# Altium schematic sheet DCF_ALIM_SWITCH_RESET.SchDoc
size A4; Author: JCD
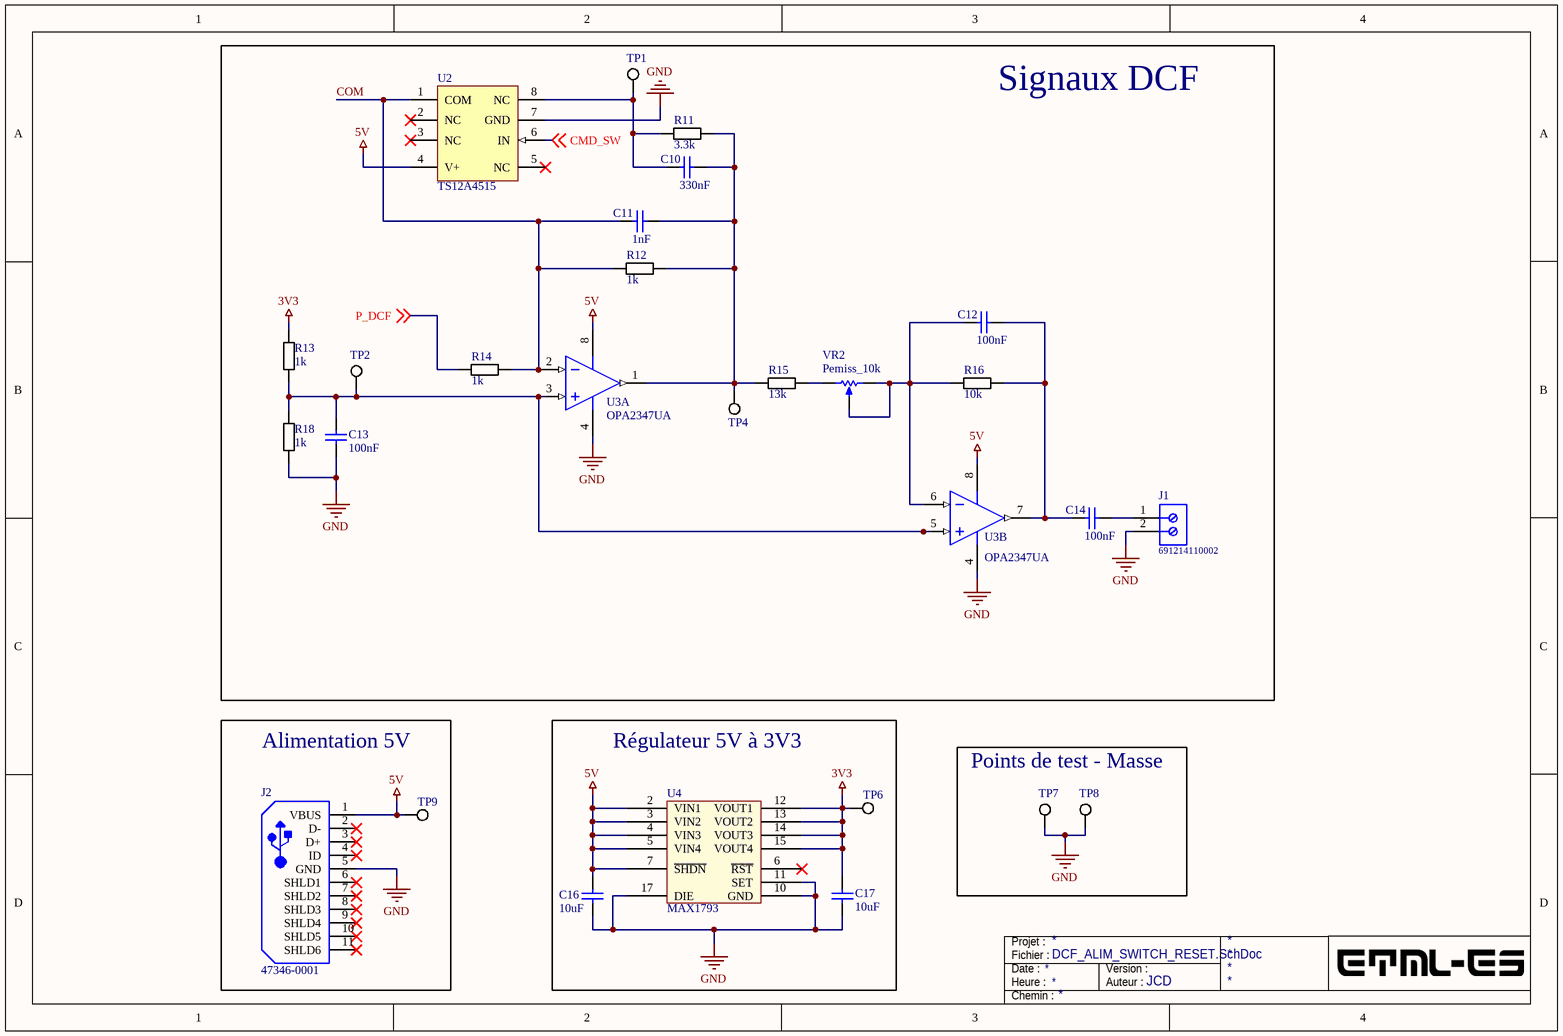
[diagram p0: DCF_ALIM_SWITCH_RESET.SchDoc]

## Parts
C10  330nF  [C0805]
C11  value 1nF  [C0805]  (hidden comment: 100nF)
C12  100nF  [C0805]
C13  100nF  [C0805]
C14  100nF  [C0805]
C16  10uF  [C0805]
C17  10uF  [C0805]
J1  691214110002  [691214110002]
J2  47346-0001  [MOLX-47346-0001-5_V]
R11  3.3k  [RESC0805(2012)_L]
R12  1k  [RESC0805(2012)_L]
R13  1k  [RESC0805(2012)_L]
R14  1k  [RESC0805(2012)_L]
R15  13k  [RESC0805(2012)_L]
R16  10k  [RESC0805(2012)_L]
R18  1k  [RESC0805(2012)_L]
TP1  5019  [KSTN-5019_V]  (value not drawn)
TP2  5019  [KSTN-5019_V]  (value not drawn)
TP4  5019  [KSTN-5019_V]  (value not drawn)
TP6  5019  [KSTN-5019_V]  (value not drawn)
TP7  5019  [KSTN-5019_V]  (value not drawn)
TP8  5019  [KSTN-5019_V]  (value not drawn)
TP9  5019  [KSTN-5019_V]  (value not drawn)
U2  TS12A4515  [TI-D8_L]
U3  OPA2347UA  [D0008A_M]  (parts A,B of 2)
U4  MAX1793  [MAX1793]
VR2  Pemiss_10k  [BOUR-3362P]

## Blocks framed on the sheet
Signaux DCF: C10-C14 J1 R11-R16 R18 TP1 TP2 TP4 U2 U3 VR2
Alimentation 5V: J2 TP9
Régulateur 5V à 3V3: C16 C17 TP6 U4
Points de test - Masse: TP7 TP8

## Nets
3V3: C17.2 R13.1 TP6.1 U4.12(VOUT1) U4.13(VOUT2) U4.14(VOUT3) U4.15(VOUT4)
5V: C16.2 J2.1(VBUS) TP9.1 U2.4(V+) U3.8(V+) U4.2(VIN1) U4.3(VIN2) U4.4(VIN3) U4.5(VIN4) U4.7(~{SHDN})
GND: C13.1 C16.1 C17.1 J1.2 J2.5(GND) R18.2 TP7.1 TP8.1 U2.7(GND) U3.4(V-) U4.10(GND) U4.11(SET) U4.17(DIE)
CMD_SW: U2.6(IN) ; off-sheet CMD_SW
COM: C11.2 R12.1 R14.2 U2.1(COM) U3.2(IN_A-)
P_DCF: R14.1 ; off-sheet P_DCF
NetC10_1: C10.1 C11.1 R11.2 R12.2 R15.1 TP4.1 U3.1(OUT_A)
NetC10_2: C10.2 R11.1 TP1.1 U2.8(NC)
NetC12_1: C12.1 C14.2 R16.2 U3.7(OUT_B)
NetC12_2: C12.2 R16.1 U3.6(IN_B-) VR2.2(S) VR2.3(CW)
NetC13_2: C13.2 R13.2 R18.1 TP2.1 U3.3(IN_A+) U3.5(IN_B+)
NetC14_1: C14.1 J1.1
NetR15_2: R15.2 VR2.1(CCW)

Not connected (* = marked no-connect by the designer): J2 2(D-)* 3(D+)* 4(ID)* 6(SHLD1)* 7(SHLD2)* 8(SHLD3)* 9(SHLD4)* 10(SHLD5)* 11(SHLD6)*; U2 2(NC)* 3(NC)* 5(NC)*; U4 6(~{RST})*

## Notes on the sheet
- Fichier :
- Date :
- Heure :
- Projet :
- Auteur :
- Version :
- Chemin :

## Library data of the parts
C10-C14 C16 C17 = Cap: Capacitor; Published: 8-Jun-2000; LatestRevisionDate: 17-Jul-2002; LatestRevisionNote: Re-released for DXP Platform.; PackageReference: RAD-0.3; Publisher: Altium Limited; PackageDescription: Radial Cap, Thru-Hole; 2 Leads; 0.3 in Pin Spacing
  C10: Value: 330nF
  C12-C14: Value: 100nF
  C16 C17: Value: 10uF
J1 = 691214110002: Serie 2141 - 3.50 mm Horizontal Entry Modular with Rising Cage Clamp WR-TBL, 2 pin; Pin Number: 2; Pitch: 3.50 mm; ComponentLink1Description: Manufacturer; ComponentLink1URL: http://www.we-online.de; ComponentLink2Description: Datasheet; ComponentLink2URL: http://katalog.we-online.de/em/datasheet/6912141100xx.pdf; Part Number: 691214110002; Published Date: June 2018; Publisher: Wurth Elektronik; Operating Temperature: -40 to 105 degC; Mounting Technology: THT; Packaging: Box
J2 = CMP-2000-05246-1: Micro-USB B Receptacle with Flange, -30 to 85 degC, 5-Pin SMD, RoHS, Tape and Reel; Manufacturer: Molex; Number of Contacts: 5; Body Orientation: RightAngle; Maximum Voltage Rating: 30VAC; Pitch: 0.65mm; Maximum Current Rating: 1.8/ContactA; Number of Ports: 1; Gender: RCP; Operating Temperature: -30to85C; Part No: 47346-0001; Color: Black; Termination Method: Solder; Contact Plating: GoldOverPalladiumNickelOverNickel; Dimension: 7.8x5.43x2.94mm; Number of Terminals: 5; Datasheet Version: Dec-13; Datasheet URL: https://datasheet.ciiva.com/30075/304740473460001-io-nectors-30075527.pdf; Contact Material: CopperAlloy; RoHS: Yes; Housing Material: LiquidCrystalPolymer; Manufacturer URL: http://www.molex.com/; Packaging: EmbossedTapeandReel; Mounting: SurfaceMount; Type: MicroUSBTypeB
R11-R16 R18 = Resistance
TP1 TP2 TP4 TP6-TP9 = CMP-1672-00008-1: Test Point, 1 Position SMD, RoHS, Tape and Reel; ComponentLink1Description: Manufacturer URL; Package Quantity: 1000; DatasheetVersion: 03/2014; Packaging: Tape and Reel; ComponentLink2URL: http://www.keyelco.com/product-pdf.cfm?p=1357; ComponentLink1URL: http://www.keyelco.com/; Mount: Surface Mount; Contact Plating: Silver; PackageDescription: 1-Pin Surface Mount Device, Body 3.81 x 2.03 mm; Pins: 1; RoHSCompliant: True; Mounting Technology: Surface Mount; ComponentLink2Description: Datasheet; PackageReference: 5019
U2 = TS12A4515: Dual Supply, Low On-State Resistance SPST CMOS Analog Switch, -40 to 85 degC, 8-Pin SOIC (D8), RoHS, Tube; Manufacturer: Texas Instruments; PartNumber: TS12A4516D; Channels: 1; Ron: 25 Ohm Max.; PackageDescription: 8-Pin Plastic Small Outline, Body 4.9 x 3.9 mm, Pitch 1.27 mm; ComponentLink1URL: http://www.ti.com/; Packing: Tube; ComponentLink2Description: Datasheet; PackageVersion: 4040047-3/M; Switch Configuration: SPST; ComponentLink1Description: Manufacturer URL; DatasheetVersion: SCDS236B; Temperature Range: -40 to 85 degC; ComponentLink3Description: Package Specification; PackageReference: D0008A; ComponentLink3URL: http://www.ti.com/lit/ml/msoi002j/msoi002j.pdf; RoHS: TRUE; ComponentLink2URL: http://www.ti.com/lit/ds/symlink/ts12a4516.pdf; Mounting Technology: Surface Mount
U3 = CMP-0272-00425-3: MicroPower, Rail-to-Rail Operational Amplifier, 2.3 to 5.5 V, -55 to 125 degC, 8-pin SOIC (D8), Green (RoHS & no Sb/Br); Manufacturer: Texas Instruments; Number of Channels: 2; Rating: Catalog; Sub Family: Low Input Bias Current Amp (<=10pA), Low Power Amp (<=500uA), Low Supply Voltage Amplifier (<=2.7V), Precision Amplifier; GBW(Typ)(MHz): 0.35; Iq per channel(Max)(mA): 0.034; Packing: TUBE; Total Supply Voltage(Min)(+5V is 5, +/-5V is 10): 2.3; Offset Drift(Typ)(uV/C): 3; IIB(Max)(pA): 10; Total Supply Voltage(Max)(+5V is 5, +/-5V is 10): 5.5; Slew Rate(Typ)(V/us): 0.17; CMRR(Min)(dB): 70; Vio (25C)(Max)(mV): 6; PackageVersion: 4040047-3/M, 06/2011; ComponentLink3Description: Package Specification; ComponentLink2Description: Datasheet; ComponentLink2URL: http://www.ti.com/lit/ds/symlink/opa2347.pdf; Mounting Technology: Surface Mount; ComponentLink3URL: http://www.ti.com/litv/pdf/msoi002j; PackageReference: D0008A; DatasheetVersion: SBOS167D; ComponentLink1Description: Manufacturer URL; ComponentLink1URL: http://www.ti.com/; Eco-Plan: Green (RoHS & no Sb/Br); Code_JEDEC: MS-012; PartNumber: OPA2347UA; PackageDescription: 8-Pin Plastic Small Outline, Body 4.9 x 3.9 mm, Pitch 1.27 mm
VR2 = CMP-1747-00004-1: Square Trimpot(R) Trimming Potentiometer, 10 KOhm, 300 V, -55 to 125 degC, 3-Pin THD, RoHS, Tube; Voltage Rating: 220 mV; Power Rating: 1 W; Tolerance: 1%; Resistance: 50 mohm; Case/Package: 1206; Length: 3.2 mm; RoHSCompliant: True; PackageDescription: 3-Pin Through Hole Device, Body 6.6 x 6.99 mm, Pitch 2.54 mm; ComponentLink2Description: Datasheet; REACH SVHC: No SVHC; Mount: Surface Mount; Height: 0.6 mm; Packaging: Tape and Reel; ComponentLink1URL: http://www.bourns.com/; Case Code (Imperial): 0612; Pins: 2; Case Code (Metric): 1632; ComponentLink2URL: http://www.bourns.com/docs/Product-Datasheets/3362.pdf; Min Operating Temperature: -25degC; ComponentLink1Description: Manufacturer URL; PackageReference: 3326P; Max Operating Temperature: 125degC; Width: 1.6 mm; Package Quantity: 5000; DatasheetVersion: May-16